# Altium schematic sheet VoltageRegulator.SchDoc
size A4
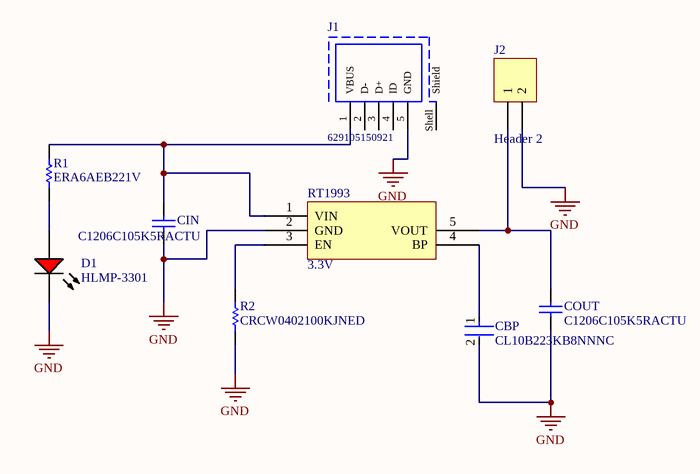
[diagram p0: VoltageRegulator.SchDoc]

## Parts
CBP  CL10B223KB8NNNC  [FP-CL10-IPC_C]
CIN  C1206C105K5RACTU  [CAPC3216X110X50LL20T25]
COUT  C1206C105K5RACTU  [CAPC3216X110X50LL20T25]
D1  HLMP-3301  [AVAG-HLMP-3301-2]
J1  629105150921  [629105150921]
J2  Header 2  [HDR1X2]
R1  ERA6AEB221V  [RESC2013X60X40NL20T25]
R2  CRCW0402100KJNED  [RESC1005X40X25LL05T05]
RT1993  3.3V  [SOT85P279X130-5N]

## Nets
GND: CBP.2 CIN.1 COUT.1 D1.1(K) J1.5(GND) J2.2 R2.1 RT1993.2(GND)
NetCBP_1: CBP.1 RT1993.4(BP)
NetCIN_2: CIN.2 J1.1(VBUS) R1.2 RT1993.1(VIN)
NetCOUT_2: COUT.2 J2.1 RT1993.5(VOUT)
NetD1_2: D1.2(A) R1.1
NetR2_2: R2.2 RT1993.3(EN)

Not connected (* = marked no-connect by the designer): J1 2(D-) 3(D+) 4(ID) Shell(Shield)

## Library data of the parts
CBP = CMP-13271-001437-1: Cap Ceramic 22nF 50V X7R ±10% Pad SMD 0603 +125°C T/R; Max Operating Temperature: 125°C; Material: Ceramic; Voltage Rating (DC): 50V; Packaging: Tape and Reel; Radiation Hardening: No; Thickness: 0.035inch; Voltage Rating: 50V; Min Operating Temperature: -55°C; Width: 0.031inch; Voltage: 50V; Lead Free: Lead Free; Contact Plating: Tin; Case Code (Imperial): 0603; Tolerance: 10%; Case Code (Metric): 1608; Capacitance: 22nF; Case/Package: 0603; Mount: Surface Mount; Height: 0.8mm; Depth: 0.8mm; Length: 1.6mm; Dielectric: X7R; Package Quantity: 1
CIN COUT = CMP-2000-06011-1: Chip Capacitor, 1 uF, +/- 10%, 50 V, -55 to 125 degC, 1206 (3216 Metric), RoHS, Tape and Reel; Manufacturer: Kemet; Case Height: 1mm; Dielectric: X7R; Voltage Rating: 50V; Capacitance: 1uF; Temperature Coefficient / Code: +/-15%; Case Length: 3.2mm; Case Width: 1.6mm; Class: Class1; Capacitance - nF: 1000nF; Datasheet URL: http://www.kemet.com/docfinder?Partnumber=C1206C105K5RACTU; Product Category: MultilayerCeramicCapacitorsMLCC-SMD/SMT; Termination Style: SMD/SMT; Dimensions: 1.6mmWx3.2mmLx1mmH; Voltage Rating DC: 50V; Datasheet Version: 02/2016; Packaging: Reel; Brand: Kemet; RoHS: Details; Minimum Operating Temperature: -55C; Operating Temperature Range: -55Cto+125C; Package Reference: 1206; Manufacturer URL: http://www.kemet.com/; Product: GeneralTypeMLCCs; Type: SMDMLCCX7R6.3-250VDCCommericalGrade; Tolerance: 10%; Package Description: 2-Pin Surface Mount Device, Body 3.2 x 1.6 mm; Mounting Technology: SurfaceMount; Case Code - mm: 3216; Maximum Operating Temperature: +125C; Series: C1206C; Factory Pack Quantity: 2500; Package / Case: 1206(3216metric); Case Code - in: 1206
D1 = CMP-2000-06411-1: T-1 3/4 (5 mm) Diffused LED Lamp, 1.9 V, -40 to 100 degC, 2-Pin THD, RoHS, Bulk; Manufacturer: Avago; Forward Current: 25mA; Forward Voltage: 2.4V; Peak Wavelength: 635nm; Shape Type: Circular; High Brightness: No; Main Category: StandardLED; Test Current (It): 10mA; Dominant Wave Length: 626nm; Number of  Elements: 1; Reverse Voltage: 5V; Chip Material: GaP; Product Height (mm): 9.19mm; Lens Type: ColoredDiffused; Viewing Angle: 60deg; Type: Uni-Color; Emitting Color: Red; Luminous Intensity: 5.4mcd; Power Dissipation: 85W; DELETED: Compliant; Product Depth (mm): 6.1mm; Package Description: 2-Pin Through Hole LED, Dia 5.85 mm; Mounting Technology: ThroughHole; Manufacturer URL: http://www.avagotech.com/; Package Type: T-13/4; Operating Temp Range: -40Cto100C; Datasheet URL: http://www.avagotech.com/docs/AV02-1558EN; Mounting: ThroughHole; Lens Dimensions: 5.08x5.08x8.3mm; Package Reference: HLMP-3301; Datasheet Version: 03/2015; Pin Count: 2; Packaging: TapeandReel; Operating Temperature Classification: Industrial; Lum Intensity: 5.4mcd; Rad Hardened: No; Product Length (mm): 6.1mm
J1 = CMP-1502-03249-1: Micro USB 2.0 Type AB Receptacle WR-COM, Horizontal, SMT; Manufacturer: Wurth Elektronik; Rated Current: 1.8A; Contact Resistance: 30mOhm; Working Voltage: 30VAC; Publisher: WurthElektronik; Part Number: 629105150921; Operating Temperature: -40to85degC; Gender: Receptacle; Packaging: TapeandReel; Connector Type: MicroUSB2.0TypeAB; Datasheet URL: https://katalog.we-online.de/em/datasheet/629105150921.pdf; Mounting Technology: SMT; Orientation: Horizontal; Package Reference: 629105150921; Manufacturer URL: http://www.we-online.de
J2 = Header 2: Header, 2-Pin; LatestRevisionDate: 17-Jul-2002; LatestRevisionNote: Re-released for DXP Platform.; Publisher: Altium Limited
R1 = CMP-2001-00612-1: Manufacturer: Panasonic; Part Number: ERA6AEB221V
R2 = CMP-2002-08125-1: Manufacturer: Vishay Dale; Part Number: CRCW0402100KJNED
RT1993 = KXEC-629051: IC REG LINEAR 3.3V 300MA SOT23-5